# EAGLE design S65-Shield_v11 (EAGLE 5.12)
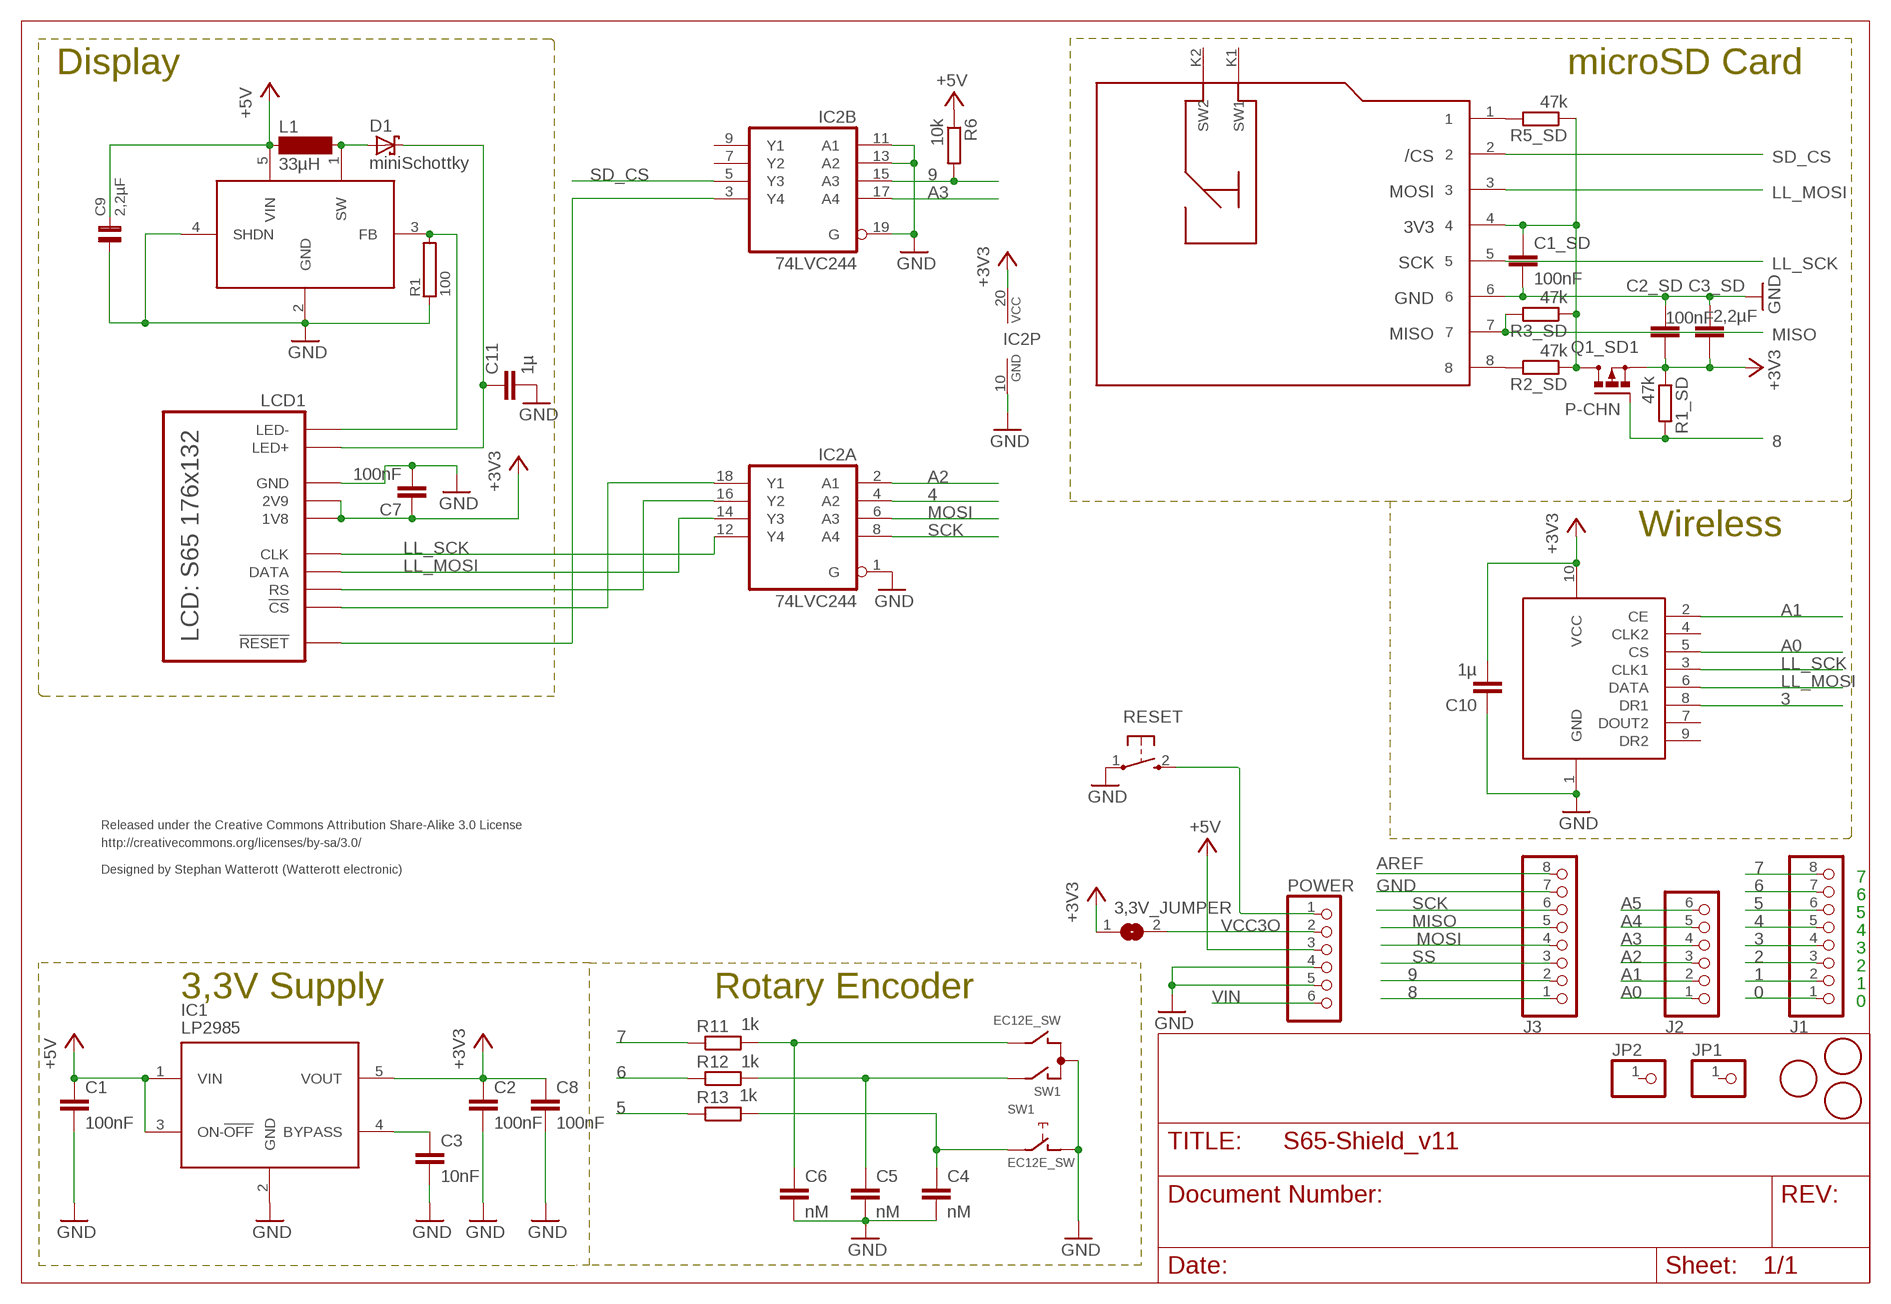
[diagram p0: schematic, sheet 1]

## Parts
3,3V_JUMPER  SJ  [SJ]
C1  100nF  C-EUC0603  [C0603]
C1_SD  100nF  C-EUC0603  [C0603]
C2  100nF  C-EUC0603  [C0603]
C2_SD  100nF  C-EUC0603  [C0603]
C3  10nF  C-EUC0603  [C0603]
C3_SD  2,2µF  C-EUC0805  [C0805]
C4  nM  C-EUC0603  [C0603]
C5  nM  C-EUC0603  [C0603]
C6  nM  C-EUC0603  [C0603]
C7  100nF  C-EUC0603  [C0603]
C8  100nF  C-EUC0805  [C0805]
C9  2,2µF  CAP0805  [0805]
C10  1µ  C-EUC0603  [C0603]
C11  1µ  C-EUC0603  [C0603]
D1  miniSchottky  DIODE0603  [D0603]
IC1  LP2985  [SOT23-5]
IC2  74LVC244  74AC244DW  [SO20W]
J1  PINHD-1X8  [1X08]
J2  PINHD-1X6  [1X06]
J3  PINHD-1X8  [1X08]
JP1  PINHD-1X1  [1X01]
JP2  PINHD-1X1  [1X01]
L1  33µH  MS42  [MS42]
LCD1  S65  [S65]
POWER  PINHD-1X6  [1X06]
Q1_SD1  P-CHN  IRLML6402  [MICRO3]
R1  100  R0603  [0603]
R1_SD  47k  R-EU_R0603  [R0603]
R2_SD  47k  R-EU_R0603  [R0603]
R3_SD  47k  R-EU_R0603  [R0603]
R5_SD  47k  R-EU_R0603  [R0603]
R6  10k  R-EU_R0603  [R0603]
R11  1k  R-EU_R0603  [R0603]
R12  1k  R-EU_R0603  [R0603]
R13  1k  R-EU_R0603  [R0603]
RESET  TAST_SMD1  [SMD_TASTER]
SD  MICRO-SD  [MICRO-SD]
SW1  EC12E_SW  [ALPS_EC12E_SW]
U$1  FIDUCIALMOUNT  [FIDUCIA-MOUNT]
U$2  FIDUCIALMOUNT  [FIDUCIA-MOUNT]
U$3  FIDUCIALMOUNT  [FIDUCIA-MOUNT]
U$4  LM2705  [SOT23-5]
U$5  TRW-2.4G  [TRW-2.4G]

## Nets
0: J1.1
1: J1.2
2: J1.3
3: J1.4 U$5.8(DR1)
4: IC2.4(A:A2) J1.5
5: J1.6 R13.1
6: J1.7 R12.1
7: J1.8 R11.1
8: J3.1 Q1_SD1.1(G) R1_SD.2
9: IC2.15(B:A3) J3.2 R6.2
+3V3: 3,3V_JUMPER.1 C2.1 C2_SD.2 C3_SD.2 C7.1 C8.1 C10.2 IC1.5(VOUT) IC2.20(P:VCC) LCD1.1V8 LCD1.2V9 Q1_SD1.2(S) R1_SD.1 U$5.10(VCC)
+5V [usbvcc]: C1.1 C9.2 IC1.1(VIN) IC1.3(ON-!OFF) L1.1 POWER.3 R6.1 U$4.5(VIN)
A0: J2.1 U$5.5(CS)
A1: J2.2 U$5.2(CE)
A2: IC2.2(A:A1) J2.3
A3: IC2.17(B:A4) J2.4
A4: J2.5
A5: J2.6
AREF [aref]: J3.8
GND [gnd]: C1.2 C1_SD.2 C2.2 C2_SD.1 C3.2 C3_SD.1 C4.2 C5.2 C6.2 C7.2 C8.2 C9.1 C10.1 C11.2 IC1.2(GND) IC2.1(A:G) IC2.10(P:GND) IC2.11(B:A1) IC2.13(B:A2) IC2.19(B:G) J3.7 LCD1.GND POWER.4 POWER.5 R1.1 RESET.1(P) SD.6 SW1.C SW1.D U$4.2(GND) U$4.4(SHDN) U$5.1(GND)
LED+: C11.1 D1.1(C) LCD1.LED+
LED-: LCD1.LED- R1.2 U$4.3(FB)
LL_MOSI: IC2.14(A:Y3) LCD1.DATA SD.3 U$5.6(DATA)
LL_SCK: IC2.12(A:Y4) LCD1.CLK SD.5 U$5.3(CLK1)
MISO: J3.5 R3_SD.2 SD.7
MOSI: IC2.6(A:A3) J3.4
N$1: R5_SD.2 SD.1
N$2: IC2.16(A:Y2) LCD1.RS
N$3: IC2.18(A:Y1) LCD1.CS(!CS)
N$4: IC2.3(B:Y4) LCD1.RESET(!RESET)
N$5: D1.2(A) L1.2 U$4.1(SW)
N$6: C4.1 R13.2 SW1.E
N$7: C5.1 R12.2 SW1.A
N$8: C6.1 R11.2 SW1.B
N$9: C3.1 IC1.4(BYPASS)
N$10: POWER.1 RESET.2(S)
N$15: R2_SD.2 SD.8
SCK: IC2.8(A:A4) J3.6
SD_3V3: C1_SD.1 Q1_SD1.3(D) R2_SD.1 R3_SD.1 R5_SD.1 SD.4
SD_CS: IC2.5(B:Y3) SD.2
SS: J3.3
VCC3O: 3,3V_JUMPER.2 POWER.2
VIN [power]: POWER.6
Unconnected: IC2.7(B:Y2) IC2.9(B:Y1) JP1.1 JP2.1 SD.K1(SW1) SD.K2(SW2) SW1.GND1(G) SW1.GND2(G) U$5.4(CLK2) U$5.7(DOUT2) U$5.9(DR2)

## Notes on the sheet
- Display | microSD Card
- Wireless
- Released under the Creative Commons Attribution Share-Alike 3.0 License
- http://creativecommons.org/licenses/by-sa/3.0/
- Designed by Stephan Watterott (Watterott electronic)
- 7
- 6
- 5
- 4
- 3
- 2
- 1
- 3,3V Supply | Rotary Encoder
- 0

## Library data of the parts
3,3V_JUMPER = jumper:SJ: SMD solder JUMPER
C1-C8 C10 C11 = resistor:C-EU: CAPACITOR, European symbol
C1_SD C2_SD C3_SD = rcl:C-EU: CAPACITOR, European symbol
C9 = SMD:CAP0805
D1 = welectronic:DIODE0603
IC1 = Voltage-Reg:LP2985
IC2 = 74xx-eu:74*244: Octal BUFFER and LINE DRIVER, 3-state
J1 J3 = pinhead:PINHD-1X8: PIN HEADER
J2 POWER = pinhead:PINHD-1X6: PIN HEADER
JP1 JP2 = pinhead:PINHD-1X1: PIN HEADER
L1 = inductor-neosid:MS42: INDUCTOR SMD inductor
LCD1 = Display:S65
Q1_SD1 = IRF-sot23:IRLML6402: P-Channel Power MOSFET
R1 = SMD:R0603
R1_SD R2_SD R3_SD R5_SD = rcl:R-EU_: RESISTOR, European symbol
R6 R11-R13 = resistor:R-EU_: RESISTOR, European symbol
RESET = Taster:TAST_SMD1
SD = SD-Card:MICRO-SD
SW1 = Encoder-IR:EC12E_SW: ALPS rotary Encoder EC12E series with switch
U$1-U$3 = SmartPrj:FIDUCIALMOUNT
U$4 = welectronic:LM2705
U$5 = welectronic:TRW-2.4G

## Net classes
0 default: width 0.254 mm, drill 0.305 mm, clearance 0.152 mm
1 power: width 0.61 mm, drill 0.508 mm, clearance 0.152 mm
2 gnd: width 0.305 mm, drill 0.508 mm, clearance 0.152 mm
3 usbvcc: width 0.508 mm, drill 0.508 mm, clearance 0.152 mm
4 aref: width 0.406 mm

## Board
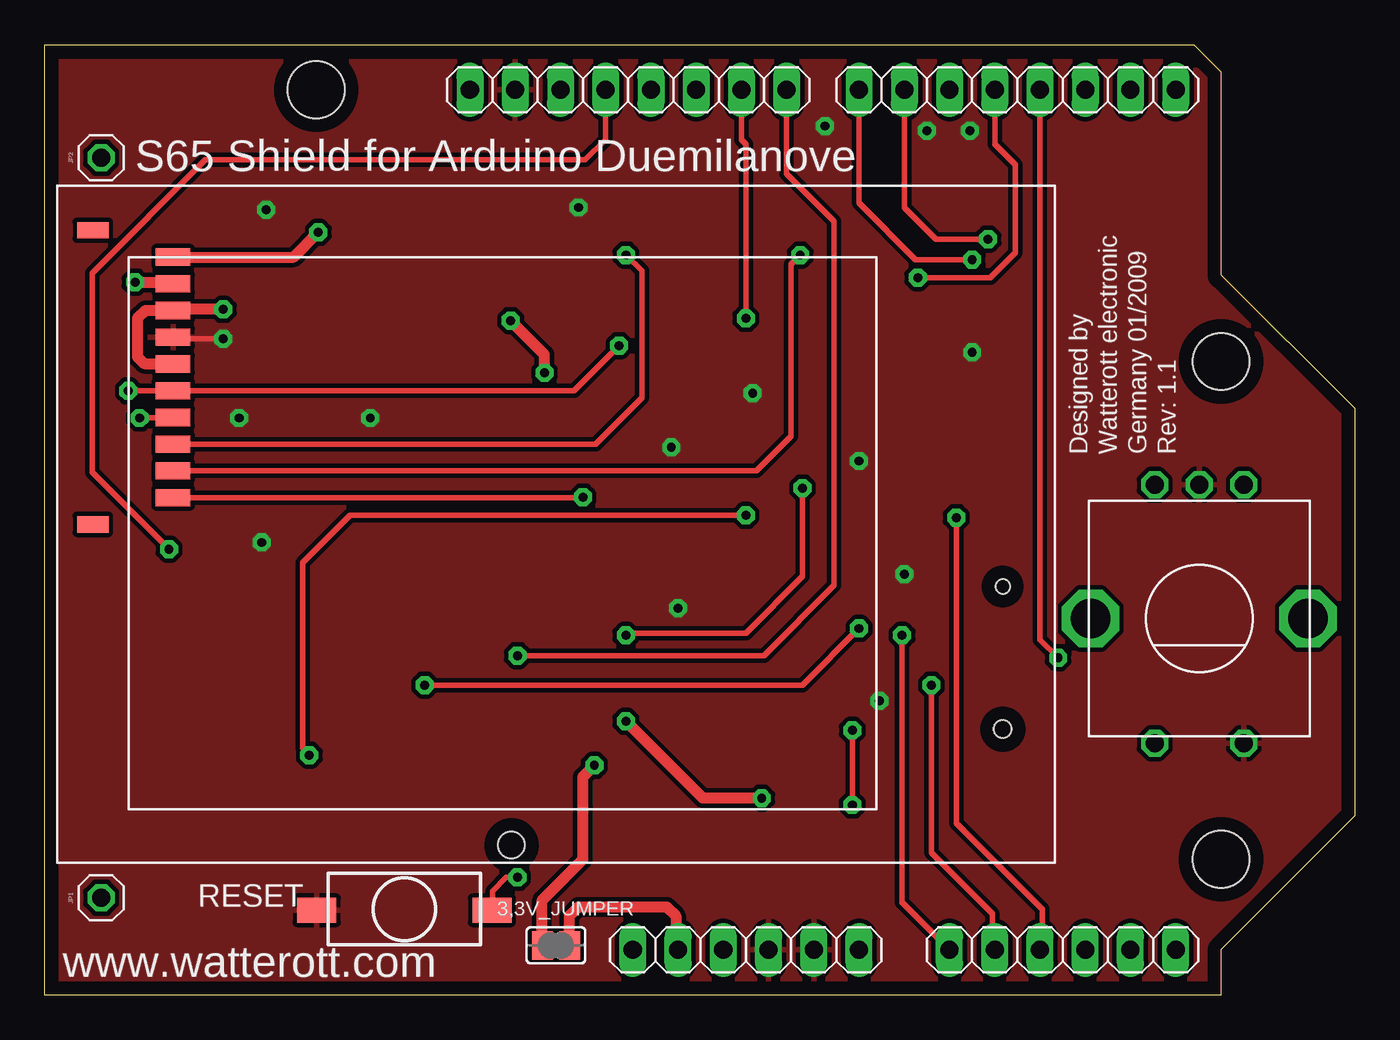
[diagram p1: board, top side]
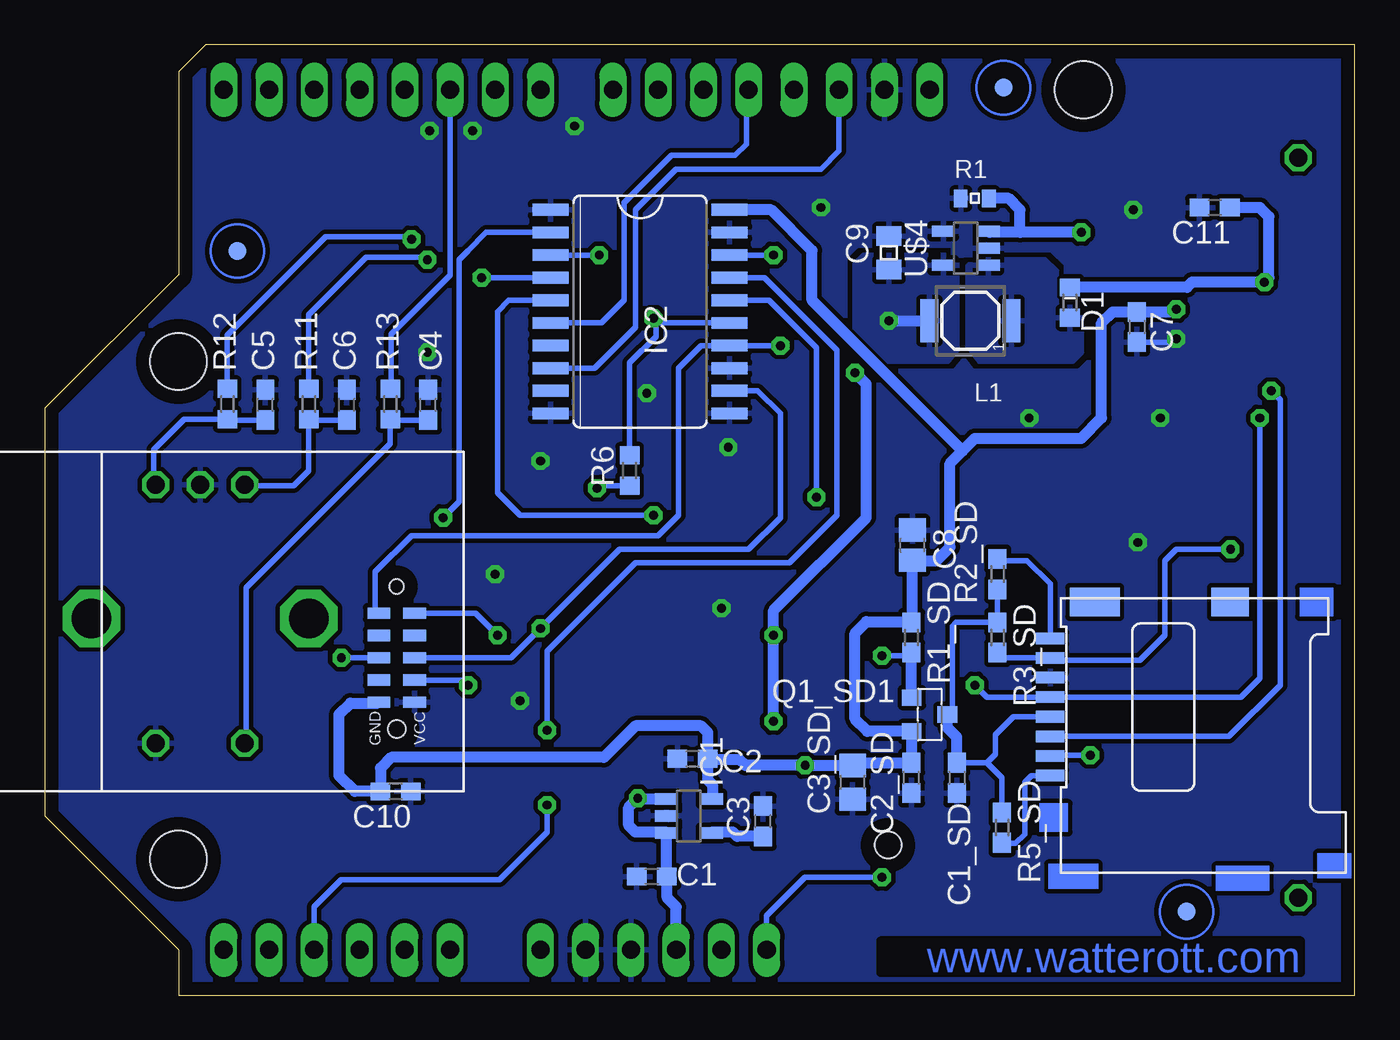
[diagram p2: board, bottom side, seen from below]

Size 73.56 x 53.34 mm. Coordinates in mm from the lower left corner, seen from the top.
Outline: 66.04,40.44 66.04,51.82 64.52,53.34 0,53.34 0,0 66.04,0 66.04,2.54 73.56,10.06 73.56,32.92 66.04,40.44
Outline: 66.04,40.44 66.04,40.39
Copper layers (1*16): Top 0.035mm / dielectric 1.5mm / Bottom 0.035mm
Design rules "default *": minimum track width 6mil, minimum drill 0.29mm, track to track 6mil, track to pad 6mil, pad to pad 6mil, via to via 6mil, smd to smd 6mil, copper to edge 30mil, drill to drill 6mil, minimum pad ring 10mil, minimum via ring 10mil, stop-mask expansion 4mil, vias tented up to drill 0.5mm, thermal gap 10mil
Holes 3.2 mm at 66.04,35.56 66.04,7.62 15.24,50.8

### Footprints (pad centres in the part's own frame; a part is rotated, then mirrored left to right if it is on the bottom)
SJ = smd 1.168 x 1.6: 1 -0.762,0; 2 0.762,0
C0603 = smd 1.1 x 1: 1 -0.85,0; 2 0.85,0
C0805 = smd 1.3 x 1.5: 1 -0.95,0; 2 0.95,0
C0805' = smd 1.3 x 1.5: 1 -0.85,0; 2 0.85,0
0805 = smd 1.092 x 1.397: 1 -0.94,0; 2 0.94,0
D0603 = smd 1 x 1.1: 1 -0.85,0; 2 0.85,0
SOT23-5 = smd 0.635 x 1.27: 1 -0.953,-1.27; 2 0,-1.27; 3 0.953,-1.27; 4 0.953,1.27; 5 -0.953,1.27
SO20W = smd 0.66 x 2.032: 1 -5.715,-5.029; 2 -4.445,-5.029; 3 -3.175,-5.029; 4 -1.905,-5.029; 5 -0.635,-5.029; 6 0.635,-5.029; 7 1.905,-5.029; 8 3.175,-5.029; 9 4.445,-5.029; 10 5.715,-5.029; 11 5.715,5.029; 12 4.445,5.029; 13 3.175,5.029; 14 1.905,5.029; 15 0.635,5.029; 16 -0.635,5.029; 17 -1.905,5.029; 18 -3.175,5.029; 19 -4.445,5.029; 20 -5.715,5.029
1X08 = drill 1.016 long: 1 -8.89,0; 2 -6.35,0; 3 -3.81,0; 4 -1.27,0; 5 1.27,0; 6 3.81,0; 7 6.35,0; 8 8.89,0
1X06 = drill 1.016 long: 1 -6.35,0; 2 -3.81,0; 3 -1.27,0; 4 1.27,0; 5 3.81,0; 6 6.35,0
1X01 = drill 1.016 octagon: 1 0,0
MS42 = smd 2.4 x 1: 1 0,2.3; 2 0,-2.3
S65 = smd 1.93 x 0.965: 1V8 6.5,31; 2V9 6.5,28; CLK 6.5,25; CS 6.5,23.5; DATA 6.5,26.5; GND 6.5,29.5; LED+ 6.5,32.5; LED- 6.5,34; RESET 6.5,22; RS 6.5,20.5 | smd 1.778 x 0.914: NC1 2,19; NC2 2,35.5 | hole 1.5: 25.5,1
MICRO3 = smd 0.9 x 1.1: 1 -0.95,-1; 2 0.95,-1; 3 0,1
0603 = smd 0.762 x 0.965: 1 -0.787,0; 2 0.787,0
R0603 = smd 1.1 x 1: 1 -0.85,0; 2 0.85,0
R0603' = smd 1 x 1.1: 1 -0.85,0; 2 0.85,0
SMD_TASTER = smd 1.4 x 2.2: 1 0.318,-4.921; 2 0.318,4.921
MICRO-SD = smd 0.65 x 1.6: 1 -10.54,16.6; 2 -9.44,16.6; 3 -8.34,16.6; 4 -7.24,16.6; 5 -6.14,16.6; 6 -5.04,16.6; 7 -3.94,16.6; 8 -2.84,16.6 | smd 1.6 x 2.1: K1 -0.8,6.5 | smd 1.6 x 2.8: K2 -0.8,14.1
ALPS_EC12E_SW = drill 1 octagon: A -2.5,-7.5; B 2.5,-7.5; C 0,-7.5; D -2.5,7; E 2.5,7 | drill 2.2 octagon: GND1 -6.1,0; GND2 6.1,0
FIDUCIA-MOUNT = smd 1.016 x 1.016: P$1 0,0
TRW-2.4G = smd 1.27 x 0.635: 1 2.75,-5; 2 2.75,-6.25; 3 2.75,-7.5; 4 2.75,-8.75; 5 2.75,-10; 6 4.75,-10; 7 4.75,-8.75; 8 4.75,-7.5; 9 4.75,-6.25; 10 4.75,-5 | hole 1: 3.75,-3.5 | hole 0.8: 3.75,-11.5

### Placement (x,y rotation side)
3,3V_JUMPER  28.7,2.79 0 top
C1  39.47,6.65 180 bottom
C1_SD  22.35,12.19 270 bottom
C2  37.19,13.26 180 bottom
C2_SD  24.89,12.19 90 bottom
C3  33.22,9.75 90 bottom
C3_SD  28.19,11.94 90 bottom
C4  52.02,33.12 90 bottom
C5  61.16,33.12 90 bottom
C6  56.59,33.12 90 bottom
C7  12.24,37.49 270 bottom
C8  100nF  [C0805']  24.84,25.25 90 bottom
C9  26.16,41.66 270 bottom
C10  53.85,11.43 180 bottom
C11  7.87,44.2 180 bottom
D1  16,38.86 270 bottom
IC1  37.39,10.06 270 bottom
IC2  40.13,38.35 270 bottom
J1  54.61,50.8 180 top
J2  57.15,2.54 0 top
J3  32.77,50.8 180 top
JP1  3.17,5.46 0 top
JP2  3.17,46.99 0 top
L1  21.59,37.85 90 bottom
LCD1  0.71,7.42 0 top
POWER  39.37,2.54 0 top
Q1_SD1  23.88,15.75 270 bottom
R1  21.34,44.7 0 bottom
R1_SD  24.89,20.07 270 bottom
R2_SD  20.07,23.62 90 bottom
R3_SD  20.07,20.07 270 bottom
R5_SD  19.81,9.4 270 bottom
R6  10k  [R0603']  40.72,29.44 90 bottom
R11  1k  [R0603']  58.72,33.17 270 bottom
R12  1k  [R0603']  63.3,33.17 270 bottom
R13  1k  [R0603']  54.15,33.17 270 bottom
RESET  20.19,5.08 270 top
SD  0.51,22.86 90 bottom
SW1  64.82,21.13 180 top
U$1  19.73,50.92 0 bottom
U$2  62.73,41.76 0 bottom
U$3  9.45,4.68 0 bottom
U$4  21.84,41.91 90 bottom
U$5  50.04,11.43 180 bottom

### Tracks (layer width: path | path; a pad name or v marks a point on that pad's centre or on a via)
3  (via drill 0.5)
  Top 0.305: J1.4 55.88,19.94 v56.9,18.92
  Bottom 0.305: v56.9,18.92 U$5.8
4  (via drill 0.5)
  Top 0.305: v49.02,40.26 53.09,40.26 54.48,41.66 54.48,46.61 53.34,47.75 J1.5
  Bottom 0.305: IC2.4 v49.02,40.26
5
  Bottom 0.305: J1.6 50.8,40.39 54.1,37.08 54.1,34.07 R13.1
6  (via drill 0.5)
  Top 0.305: v52.96,42.42 50.04,42.42 48.26,44.2 J1.7
  Bottom 0.305: R12.1 63.3,37.03 57.78,42.55 53.09,42.55 v52.96,42.42
7  (via drill 0.5)
  Top 0.305: v52.07,41.27 48.9,41.27 45.72,44.45 J1.8
  Bottom 0.305: R11.1 58.73,38.18 55.5,41.4 52.2,41.4 v52.07,41.27
8  (via drill 0.5)
  Top 0.305: J3.1 41.66,46.1 44.32,43.43 44.32,22.99 40.39,19.05 v26.54,19.05
  Bottom 0.305: v26.54,19.05 25.06,19.05 R1_SD.2
  Bottom 0.61: R1_SD.2 24.89,16.71 Q1_SD1.1
9  (via drill 0.5)
  Top 0.305: v39.37,37.97 39.37,47.75 39.12,48.01 J3.2
  Bottom 0.305: IC2.15 39.12,37.72 v39.37,37.97 39.24,37.85 39.24,36.96 40.72,35.48 R6.2
+3V3  (via drill 0.5)
  Top 0.305: 7.28,38.48 LCD1.1V8 | 7.2,35.43 LCD1.2V9
  Top 0.61: v10.03,38.48 7.28,38.48 | LCD1.1V8 5.65,38.42 5.21,37.97 5.21,35.81 5.59,35.43 7.2,35.43 | 3,3V_JUMPER.1 27.94,5.33 30.23,7.62 30.23,12.25 v30.86,12.89
  Bottom 0.305: 10.17,38.34 v10.03,38.48 | 24.83,24.38 C8.1
  Bottom 0.61: 10.17,38.34 C7.1 13.6,38.34 14.22,37.72 14.22,32.38 15.37,31.24 21.34,31.24 22.04,30.54 | 22.04,30.54 22.73,29.84 22.73,25.15 23.5,24.38 24.83,24.38 24.83,20.98 R1_SD.1 24.93,20.95 27.43,20.95 28.07,20.32 28.07,15.49 27.37,14.8 Q1_SD1.2 24.88,13.06 C2_SD.2 28.04,13.04 C3_SD.2 v30.86,12.89 34.22,12.89 34.54,13.21 36.28,13.21 C2.1 | C2.1 36.34,12.08 36.07,11.81 36.07,11.06 IC1.5 | U$5.10 54.84,16.38 56.39,16.38 57.02,15.75 57.02,12.32 56.13,11.43 C10.2 54.7,12.74 54.1,13.34 42.16,13.34 40.39,15.11 36.7,15.11 36.32,14.73 36.32,13.27 C2.1 | IC2.20 32.77,44.07 30.48,41.78 30.48,38.99 22.04,30.54
+5V  (via drill 0.5)
  Top 0.305: v42.55,28.45 42.55,23.5 39.37,20.32 32.77,20.32 v32.64,20.19
  Top 0.61: v40.26,11.05 36.96,11.05 v32.64,15.37 | v28.07,34.92 28.07,35.94 v26.16,37.85
  Bottom 0.305: IC1.1 40.22,11.01 v40.26,11.05 | R6.1 42.4,28.59 v42.55,28.45
  Bottom 0.61: POWER.3 38.1,4.95 38.61,5.46 38.61,6.64 C1.1 38.66,6.69 IC1.3 38.7,9.14 40.39,9.14 40.77,9.53 40.77,10.54 40.3,11.01 IC1.1 | v32.64,15.37 v32.64,20.19 32.64,21.59 32.58,21.65 27.43,26.8 27.43,34.29 v28.07,34.92 | v26.16,37.85 L1.1
  pour Bottom: 27.56,41.53 22.48,41.53 22.35,41.27 22.35,36.2 22.86,35.56 27.69,35.56 28.07,35.94 28.07,41.02
A0  (via drill 0.5)
  Top 0.305: v48.13,20.19 48.13,5.21 J2.1
  Bottom 0.305: U$5.5 49.37,21.43 v48.13,20.19
A1  (via drill 0.5)
  Top 0.305: v49.78,17.4 49.78,8 53.21,4.57 53.21,2.67 J2.2
  Bottom 0.305: U$5.2 50.06,17.68 v49.78,17.4
A2  (via drill 0.5)
  Top 0.305: J2.3 56.01,2.67 56.01,4.83 51.18,9.65 v51.18,26.8
  Bottom 0.305: IC2.2 48.77,42.8 49.78,41.78 | 49.78,41.78 50.04,41.53 | 49.78,41.78 50.29,41.27 50.29,29.97 50.29,27.69 v51.18,26.8
A3  (via drill 0.5)
  Top 0.305: v45.34,10.67 v45.34,14.86
  Bottom 0.305: IC2.17 33.15,40.26 29.08,36.2 29.08,26.92 31.75,24.26 40.39,24.26 45.34,19.3 v45.34,14.86 | v45.34,10.67 45.34,9.14 48.01,6.48 56.9,6.48 58.42,4.95 J2.4
GND  (via drill 0.5)
  Top 0.305: v10.03,36.83 7.3,36.83 LCD1.GND
  Bottom 0.305: C7.2 10.22,36.64 v10.03,36.83
  other vias: 35.56,21.72 52.07,36.07 45.72,29.97 29.97,44.2 43.81,48.77 39.75,33.78 12.45,44.07 12.19,25.4 10.92,32.38 18.29,32.38 35.18,30.73 46.86,16.51 49.53,48.51 51.94,48.51 48.26,23.62
  pour Bottom (isolate 0.254, rank 2): 0.64,52.7 73.03,52.7 73.03,0.89 0.89,0.64 0.64,0.89
  pour Top (isolate 0.254, rank 2): 0.64,52.7 73.03,52.7 73.03,0.64 0.64,0.64
LED+  (via drill 0.5)
  Top 0.305: 7.12,40.01 LCD1.LED+
  Top 0.61: v5.08,40.01 7.12,40.01
  Bottom 0.305: 4.83,40.26 v5.08,40.01
  Bottom 0.61: C11.1 5.33,44.2 4.83,43.69 4.83,40.26 | D1.1 9.44,39.71 9.14,40.01 v5.08,40.01
LED-  (via drill 0.5)
  Top 0.61: LCD1.LED- 13.98,41.42 v15.37,42.8
  Bottom 0.61: v15.37,42.8 18.8,42.8 | 18.8,42.8 20.51,42.8 U$4.3 | R1.2 19.43,44.7 18.8,44.07 18.8,42.8
LL_MOSI  (via drill 0.5)
  Top 0.305: v4.7,33.91 7.2,33.91 LCD1.DATA 29.73,33.92 v32.26,36.45
  Bottom 0.305: SD.3 7.07,14.52 4.19,17.4 4.19,33.4 v4.7,33.91 | IC2.14 34.98,36.32 | U$5.6 54.99,21.63 54.99,23.75 52.96,25.78 39.12,25.78 37.97,26.92 37.97,35.18 36.7,36.45 IC2.14 | v32.26,36.45 IC2.14
LL_SCK  (via drill 0.5)
  Top 0.305: v5.33,32.38 7.18,32.38 LCD1.CLK | v21.34,17.4 42.55,17.4 v45.72,20.57
  Bottom 0.305: v5.33,32.38 5.33,17.78 6.39,16.72 SD.5 20.66,16.72 v21.34,17.4 | U$5.3 47.36,18.93 v45.72,20.57 41.27,25.02 34.04,25.02 32.26,26.8 32.26,32.64 33.53,33.91 IC2.12
MISO  (via drill 0.5)
  Top 0.305: J3.5 31.5,48.01 30.35,46.86 9.02,46.86 2.67,40.51 2.67,29.34 v6.99,25.02
  Bottom 0.305: R3_SD.2 19.77,18.92 SD.7 16.98,18.8 12.06,18.8 10.67,20.19 10.67,24.38 10.03,25.02 v6.99,25.02
MOSI
  Bottom 0.305: IC2.6 42.29,37.72 41.02,38.99 41.02,44.45 38.35,47.12 34.8,47.12 34.16,47.75 34.16,50.67 J3.4
N$1
  Bottom 0.305: SD.1 18.16,12.32 18.54,11.94 18.54,9.02 19.05,8.51 19.77,8.51 R5_SD.2
N$2  (via drill 0.5)
  Top 0.305: LCD1.RS 30.2,27.92 v30.23,27.94
  Bottom 0.305: v30.23,27.94 30.23,36.32 32.89,38.99 IC2.16
N$3  (via drill 0.5)
  Top 0.305: LCD1.CS 30.92,30.92 33.53,33.53 33.53,40.64 v32.64,41.53
  Bottom 0.305: v32.64,41.53 IC2.18
N$4  (via drill 0.5)
  Top 0.305: LCD1.RESET 39.96,29.42 41.91,31.37 41.91,41.02 v42.42,41.53
  Bottom 0.305: v42.42,41.53 IC2.3
N$5
  pour Bottom: 17.4,41.27 21.34,41.27 21.72,40.89 21.72,36.45 21.08,35.56 15.88,35.56 15.37,36.07 15.37,38.23 15.75,38.61 16.76,38.61 16.76,40.64
N$6
  Bottom 0.305: C4.1 54.1,32.27 R13.2 54.15,30.94 62.23,22.86 62.23,14.22 SW1.E
N$7
  Bottom 0.305: C5.1 63.25,32.27 R12.2 65.72,32.32 67.44,30.61 67.44,28.75 SW1.A
N$8
  Bottom 0.305: C6.1 58.67,32.27 R11.2 58.73,29.41 59.56,28.57 62.26,28.57 SW1.B
N$9
  Bottom 0.61: C3.1 34.69,8.9 34.92,9.14 36.08,9.14 IC1.4
N$10  (via drill 0.5)
  Top 0.305: v26.54,6.6 25.91,6.6 25.15,5.84 25.15,4.79 RESET.2
  Bottom 0.305: POWER.1 33.02,4.45 30.86,6.6 v26.54,6.6
N$15
  Bottom 0.305: SD.8 17.11,23.08 18.41,24.38 19.98,24.38 R2_SD.2
SCK
  Bottom 0.305: IC2.8 42.67,35.18 40.39,37.47 40.39,44.07 38.1,46.35 29.97,46.35 28.96,47.37 J3.6
SD_3V3
  Bottom 0.305: 20.66,13.04 C1_SD.1 | 20.66,13.04 19.81,12.19 R5_SD.1 | SD.4 19.18,15.62 20.19,14.61 20.19,13.51 20.66,13.04 | R2_SD.1 R3_SD.1 22.39,20.92 22.61,20.7 22.61,16.02 Q1_SD1.3
  Bottom 0.61: Q1_SD1.3 22.88,15 22.35,14.48 C1_SD.1
SD_CS  (via drill 0.5)
  Top 0.305: 16.7,26.48 14.48,24.26 14.48,13.84 v14.86,13.46 | 16.7,26.48 17.02,26.8 | v39.37,26.92 17.14,26.92 16.7,26.48
  Bottom 0.305: 17.14,13.46 SD.2 17.07,13.46 v14.86,13.46 | IC2.5 47.5,38.99 48.13,38.35 48.13,28.19 46.86,26.92 v39.37,26.92
VCC3O
  Top 0.61: 3,3V_JUMPER.2 29.46,4.45 29.97,4.95 34.92,4.95 35.43,4.45 35.43,2.67 POWER.2

### Text on the board
Bottom: www.watterott.com
tPlace: www.watterott.com
tNames: S65 Shield for Arduino Duemilanove | Designed by | Watterott electronic | Germany 01/2009 | Rev: 1.1